# EAGLE schematic rfmacpower (EAGLE 9.2.2)
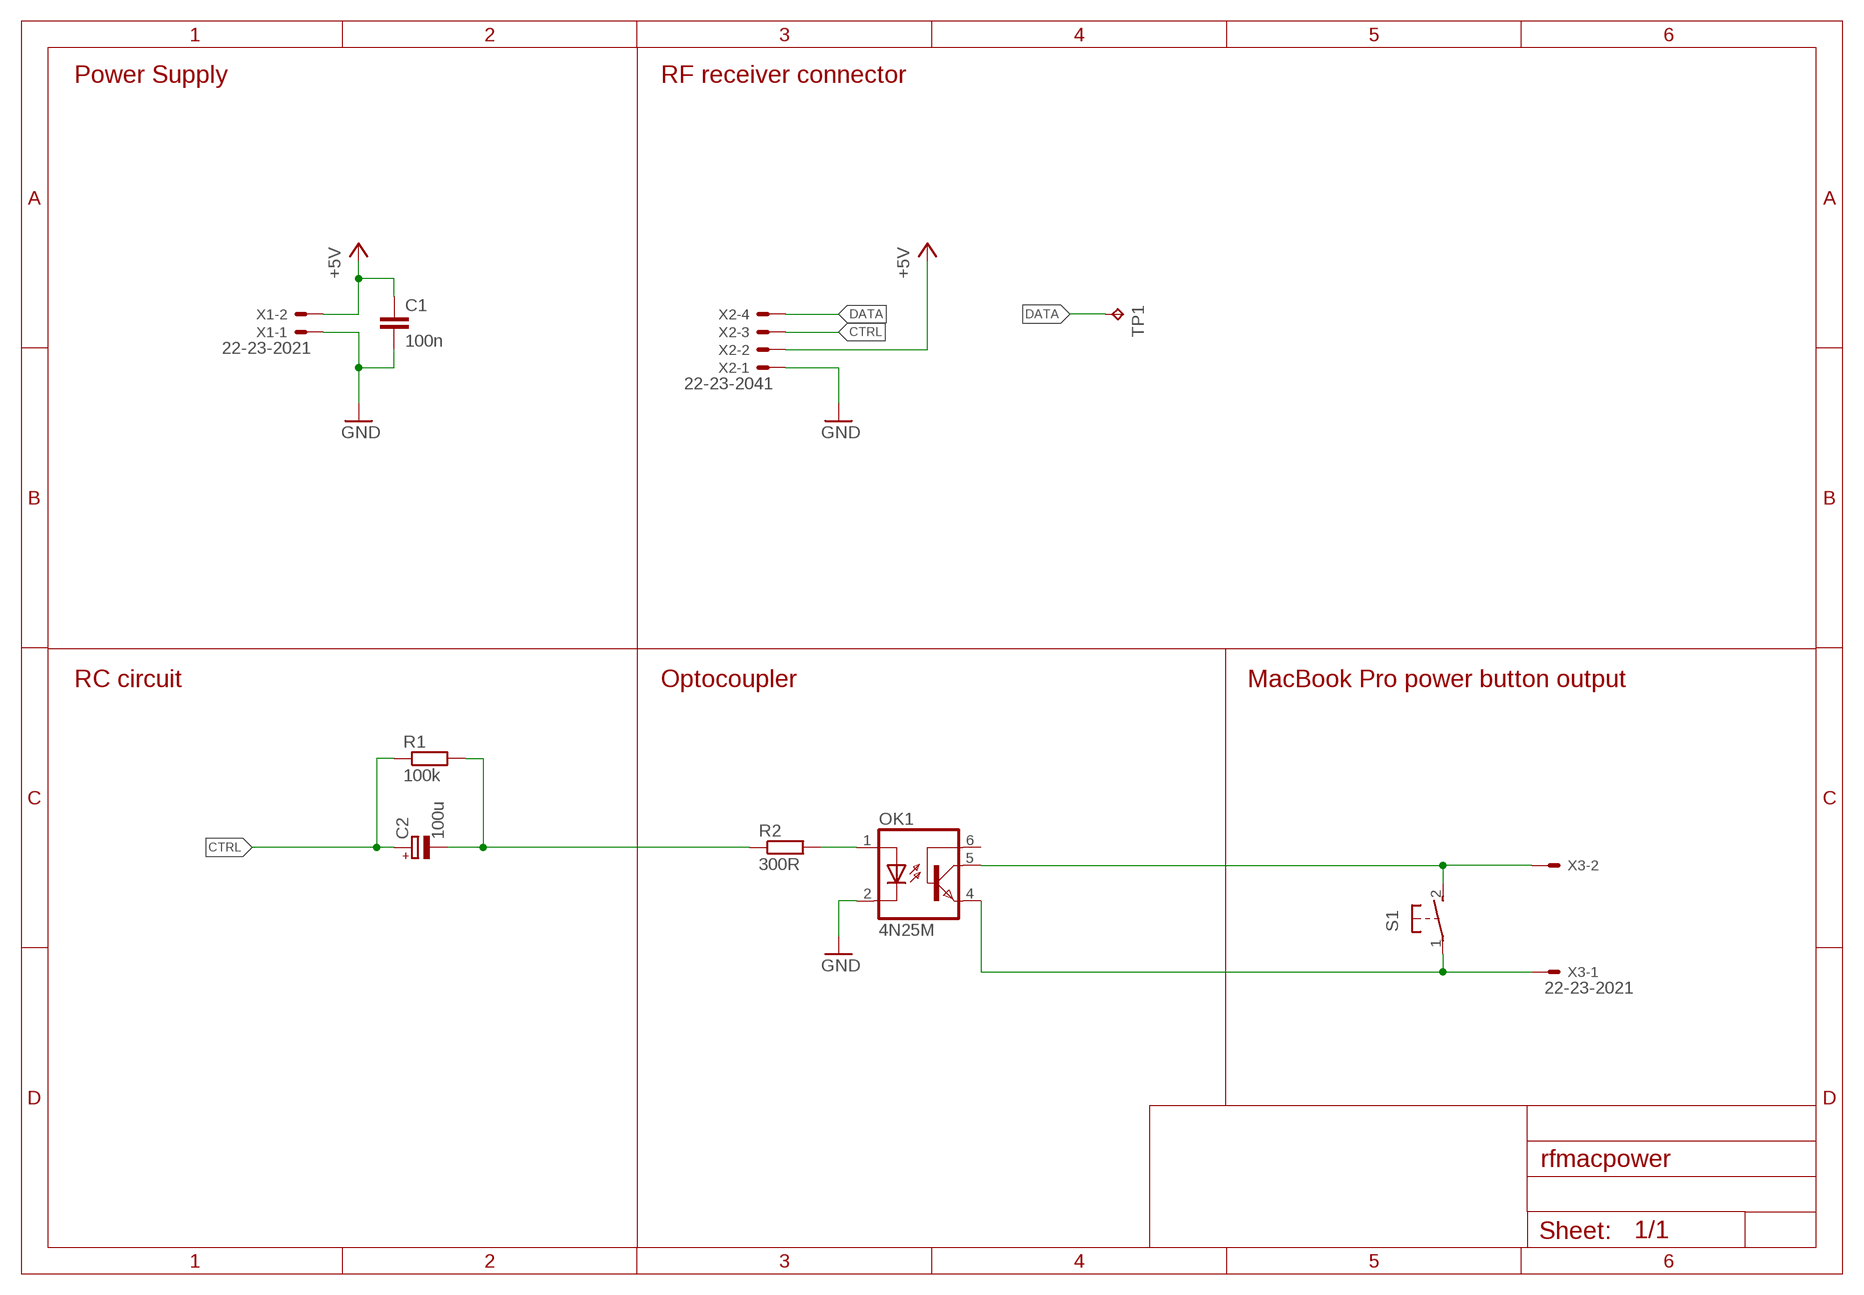
[diagram p0: schematic, sheet 1]

## Parts
C1  100n  C-EU025-024X044  [C025-024X044]
C2  100u  CPOL-EUE2.5-7  [E2,5-7]
OK1  4N25M  [DIL06]
R1  100k  R-EU_0204/7  [0204/7]
R2  300R  R-EU_0204/7  [0204/7]
S1  DTS-3  [DTS-3]
TP1  TPPAD1-13  [P1-13]
X1  22-23-2021  [22-23-2021]
X2  22-23-2041  [22-23-2041]
X3  22-23-2021  [22-23-2021]

## Nets
+5V: C1.1 X1.2 X2.2
CTRL: C2.+ R1.1 X2.3
DATA: TP1.TP X2.4
GND: C1.2 OK1.2(C) X1.1 X2.1
N$1: OK1.5(COL) S1.2 X3.2
N$2: OK1.4(EMI) S1.1 X3.1
N$3: OK1.1(A) R2.2
N$4: C2.- R1.2 R2.1
Unconnected: OK1.6(BAS)

## Notes on the sheet
- Power Supply | RF receiver connector
- RC circuit | Optocoupler | MacBook Pro power button output

## Library data of the parts
C1 = rcl:C-EU: CAPACITOR, European symbol; SPICEPREFIX: C
C2 = rcl:CPOL-EU: POLARIZED CAPACITOR, European symbol; SPICEPREFIX: C
OK1 = optocoupler:4N*?M: General Purpose 6-Pin Phototransistor Optocouplers Source: http://www.fairchildsemi.com/ds/4N/4N35-M.pdf; MPN: 4N25-M; OC_FARNELL: 1021349; OC_NEWARK: 98K9084
R1 R2 = rcl:R-EU_: RESISTOR, European symbol; SPICEPREFIX: R
S1 = switch-tact:DTS-3
TP1 = testpad:TP: Test pad
X1 X3 = con-molex:22-23-2021: .100" (2.54mm) Center Header - 2 Pin; MF: MOLEX; MPN: 22-23-2021; OC_FARNELL: 1462926; OC_NEWARK: 25C3832
X2 = con-molex:22-23-2041: .100" (2.54mm) Center Header - 4 Pin; MF: MOLEX; MPN: 22-23-2041; OC_FARNELL: 1462920; OC_NEWARK: 38C0355